# Altium schematic sheet PowerSupply.SchDoc
size A4; Author: Timo Wilfling; Address1: TH Nürnberg; Address2: Georg Simon Ohm; Address3: Kesslerplatz 10; Address4: 90489 Nürnberg; SheetNumber: 2; SheetTotal: 8
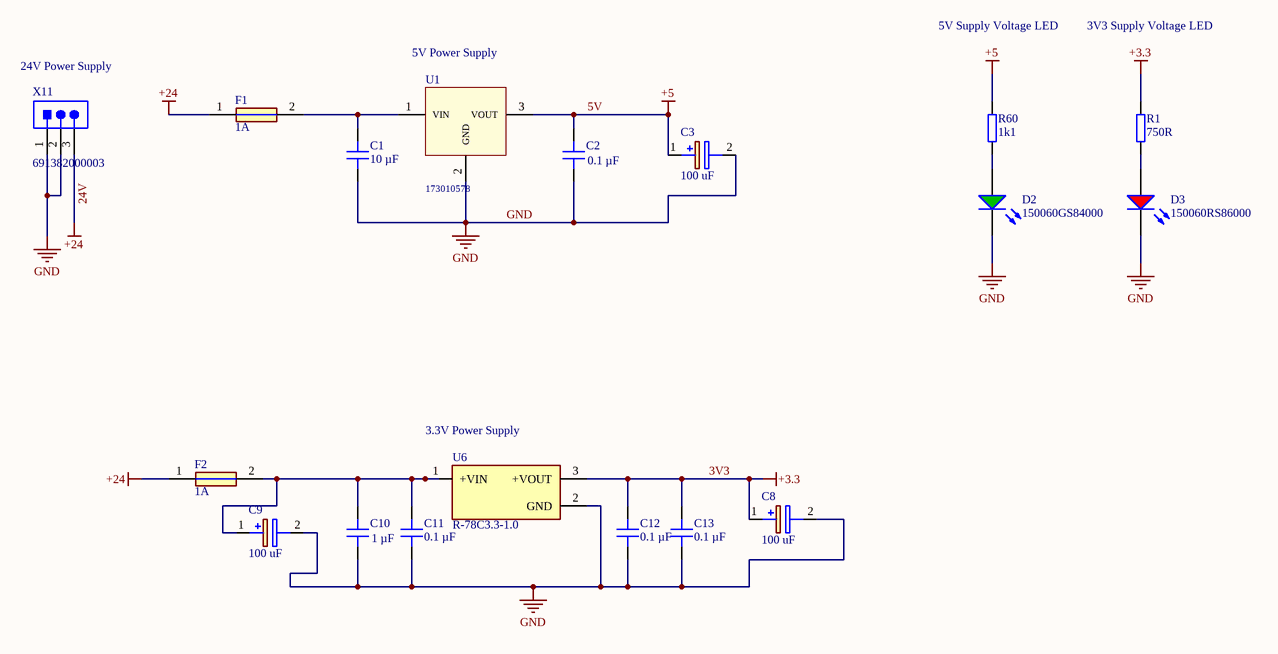
[diagram p0: PowerSupply.SchDoc]

## Parts
C1  10 µF  [C_0805]
C2  0.1 µF  [C_0603]
C3  100 uF  [CAPAE660X610N]
C8  100 uF  [CAPAE1270X1400N]
C9  100 uF  [CAPAE1270X1400N]
C10  1 µF  [C_0603]
C11  0.1 µF  [C_0603]
C12  0.1 µF  [C_0603]
C13  0.1 µF  [C_0603]
D2  150060GS84000  [WL-SMCW_0603]
D3  150060RS86000  [WL-SMCW_0603]
F1  1A  [Littlefuse_154]
F2  1A  [Littlefuse_154]
R1  750R  [RES 0603_1608]
R60  1k1  [RES 0603_1608]
U1  173010578  [FDSM_SIP-3]
U6  R-78C3.3-1.0  [CONV_R-78C3.3-1.0]
X11  691382000003  [691382000003]

## Nets
3V3: C8.1(+) C12.2 C13.2 R1.2 U6.3(+VOUT)  [also labelled +3.3]
5V: C2.2 C3.1(+) R60.2 U1.3(VOUT)  [also labelled +5]
24V: F1.1 F2.1 X11.3  [also labelled +24]
GND: C1.1 C2.1 C3.2(-) C8.2(-) C9.2(-) C10.1 C11.1 C12.1 C13.1 D2.1(K) D3.1(K) U1.2(GND) U6.2(GND) X11.1 X11.2
NetC1_2: C1.2 F1.2 U1.1(VIN)
NetC9_1: C9.1(+) C10.2 C11.2 F2.2 U6.1(+VIN)
NetD2_2: D2.2(A) R60.1
NetD3_2: D3.2(A) R1.1

## Notes on the sheet
- 24V Power Supply
- 5V Power Supply
- 5V Supply Voltage LED
- 3V3 Supply Voltage LED
- (near U6) 3.3V Power Supply
- Title
- Size:
- Date:
- A4
- Revision:
- Time:
- Sheet
- of
- Author:
- Project:

## Library data of the parts
C1 = GRM219R61E106KA12D: Capacitor 0805, 25 VDC, 10 µF, X5R; Manufacturer: muRata; Tolerance: 10 %; Voltage Rating: 25 VDC; Created from: MGremer; Manufacturer Part Number: GRM219R61E106KA12D; PartID: 13; Created On: 20.12.2020 13:54:13; ComponentLink1Description: Datasheet; ComponentLink1URL: https://www.mouser.de/datasheet/2/281/murata_03052018_GRM_Series_1-1310166.pdf; Component Type: Capacitor 0805; Device Package: 0805; Last Updated: 20.12.2020 16:34:30; Mounting Type: SMD; Operating Temperature: -55 - 85°C; Series: GRM; Supplier 1: Mouser; Supplier Part Number 1: 81-GRM219R61E106KA2D; Type: Capacitor; Value: 10 µF; Live Cycle Status: 1; Stock number: Labor SMD Container
C2 = C0603C104J3REC7411: Capacitor 0603, 25 VDC, 0.1 µF, X7R; Manufacturer: KEMET; Tolerance: 5 %; Voltage Rating: 25 VDC; Created from: MGremer; Manufacturer Part Number: C0603C104J3REC7411; PartID: 2; Created On: 20.12.2020 13:54:13; ComponentLink1Description: Datasheet; ComponentLink1URL: https://www.mouser.de/datasheet/2/212/1/KEM_C1090_X7R_ESD-1103328.pdf; Component Type: Capacitor 0603; Device Package: 0603; Last Updated: 20.12.2020 16:43:29; Mounting Type: SMD; Operating Temperature: -55 - 125°C; Series: ESD SMD Auto X7R; Supplier 1: Mouser; Supplier Part Number 1: 80-C0603C104J3RE7411; Type: Capacitor; Value: 0.1 µF; Live Cycle Status: 1; Stock number: Labor SMD Container
C3 = EEE-FK0J101V: Capacitor EEE, 6.3VDC, 100uF; Manufacturer: Panasonic; Tolerance: 20%; Created from: TWilfling; Manufacturer Part Number: EEE-FK0J101V; PartID: 71; Created On: 28.05.2021 17:07:38; ComponentLink1Description: Datasheet; ComponentLink1URL: https://www.mouser.de/datasheet/2/315/ABA0000C1181-947564.pdf; Component Type: Capacitor Al Electrolyt; Device Package: EEE; Last Updated: 28.05.2021 17:48:36; Mounting Type: SMD; Operating Temperature: -55 - 105°C; Series: FK-V; Supplier 1: Mouser; Supplier Part Number 1: 667-EEE-FK0J101V; Type: Capacitor; Voltage Rating: 6.3 VDC; Value: 100 uF; Live Cycle Status: 1; Stock number: not stored
C8 C9 = MAL216099101E3: Capacitor Al Electrolyt, 100 uF, 50VDC; Manufacturer: Vishay; Tolerance: 20%; Created from: TWilfling; Manufacturer Part Number: MAL216099101E3; PartID: 72; Created On: 28.05.2021 17:32:00; ComponentLink1Description: Datasheet; ComponentLink1URL: https://www.mouser.de/datasheet/2/427/160cla-1762101.pdf; Component Type: Capacitor Al Electrolyt; Last Updated: 28.05.2021 17:47:40; Mounting Type: SMD; Operating Temperature: -55 - 150°C; Series: 160 CLA; Supplier 1: Mouser; Supplier Part Number 1: 594-MAL216099101E3; Type: Capacitor; Voltage Rating: 50 VDC; Value: 100 uF; Live Cycle Status: 1; Stock number: not stored
C10 = UMK107AB7105KA-T: Capacitor 0603, 50 VDC, 1 µF, X7R; Manufacturer: Taiyo Yuden; Tolerance: 10 %; Voltage Rating: 50 VDC; Created from: MGremer; Manufacturer Part Number: UMK107AB7105KA-T; PartID: 5; Created On: 20.12.2020 13:54:13; ComponentLink1Description: Datasheet; ComponentLink1URL: https://www.mouser.de/datasheet/2/396/mlcc02_e-1307760.pdf; Component Type: Capacitor 0603; Device Package: 0603; Last Updated: 20.12.2020 16:42:28; Mounting Type: SMD; Operating Temperature: -55 - 125°C; Series: M; Supplier 1: Mouser; Supplier Part Number 1: 963-UMK107AB7105KA-T; Type: Capacitor; Value: 1 µF; Live Cycle Status: 1; Stock number: Labor SMD Container
C11-C13 = C0603X104K5RAC7411: Capacitor 0603, 50 VDC, 0.1 µF, X7R; Manufacturer: KEMET; Tolerance: 10 %; Voltage Rating: 50 VDC; Created from: MGremer; Manufacturer Part Number: C0603X104K5RAC7411; PartID: 3; Created On: 20.12.2020 13:54:13; ComponentLink1Description: Datasheet; ComponentLink1URL: https://www.mouser.de/datasheet/2/212/1/KEM_C1013_X7R_FT_CAP_SMD-1103280.pdf; Component Type: Capacitor 0603; Device Package: 0603; Last Updated: 04.03.2021 09:24:28; Mounting Type: SMD; Operating Temperature: -55 - 125°C; Series: SMD Comm X7R Flex; Supplier 1: Mouser; Supplier Part Number 1: 80-C0603X104K5R7411; Supplier 2: LCSC; Supplier Part Number 2: C14663; Type: Capacitor; Value: 0.1 µF; Live Cycle Status: 1; LCSC Part Number: C14663; Stock number: Labor SMD Container
D2 = 150060GS84000: WL-SMCW SMD Mono-color Chip LED Waterclear Green; Manufacturer: Wuerth Elektronik; Type: Standard; Created from: MGremer; Forward Current I_f: 20 mA; Forward Voltage U_f: 3.2 V; Wavelength: 525 nm; Light Intensity: 3000 mcd; Nominal Power: 78 mW; Manufacturer Part Number: 150060GS84000; PartID: 2; Created On: 08.12.2020 10:41:11; ComponentLink1Description: Datasheet; ComponentLink1URL: https://www.mouser.de/datasheet/2/445/150060GS75020-1714345.pdf; Component Type: LED Diode; Device Package: 0603; Last Updated: 03.03.2021 09:59:51; Mounting Type: SMD; Operating Temperature: -40 - 85 °C; Supplier 1: Mouser; Supplier Part Number 1: 710-150060GS84000; Supplier 2: Farnell; Supplier Part Number 2: 3408612; Supplier 3: Digi-Key; Supplier Part Number 3: 732-150060GS84000CT-ND; Live Cycle Status: 1; Stock number: not stored; Color: green
D3 = 150060RS86000: WL-SMCW SMD Mono-color Chip LED Waterclear Red; Manufacturer: Wuerth Elektronik; Type: Standard; Created from: MGremer; Forward Current I_f: 20 mA; Forward Voltage U_f: 2 V; Wavelength: 624 nm; Light Intensity: 800 mcd; Nominal Power: 48 mW; Manufacturer Part Number: 150060RS86000; PartID: 3; Created On: 08.12.2020 10:48:12; ComponentLink1Description: Datasheet; ComponentLink1URL: https://www.mouser.de/datasheet/2/445/150120RS75000-1714636.pdf; Component Type: LED Diode; Device Package: 0603; Last Updated: 03.03.2021 09:59:52; Mounting Type: SMD; Operating Temperature: -40 - 85 °C; Supplier 1: Mouser; Supplier Part Number 1: 710-150060RS86000; Supplier 2: Farnell; Supplier Part Number 2: 3408608; Supplier 3: Digi-Key; Supplier Part Number 3: 732-150060RS86000CT-ND; Live Cycle Status: 1; Stock number: not stored; Color: red
F1 F2 = 0154001.DR: Duse OMNI BLOK 154; Manufacturer: Littelfuse; Type: Fuse; Nominal voltage AC: 125 VAC; Nominal voltage DC: 125 VDC; Resistance: 78 mOhm; Created from: TWilfling; Manufacturer Part Number: 0154001.DR; PartID: 4; Created On: 07.05.2021 06:50:33; ComponentLink1Description: Datasheet; ComponentLink1URL: https://www.mouser.de/datasheet/2/240/Littelfuse_Fuse_154_154T_154L_154TL_Datasheet_pdf-365375.pdf; Component Type: NAN02 - 154 OMNI-BLOK; Device Package: OMNI-BLOK; Last Updated: 11.05.2021 11:17:19; Mounting Type: SMD; Operating Temperature: -55 - 125 °C; Series: 154; Supplier 1: Mouser; Supplier Part Number 1: 576-0154001.DR; Nominal current: 1 A; Value: 1 A; Live Cycle Status: 1; Stock number: not stored
R1 = RK73B1JTTDD751J: SMD resistor E24 series; Manufacturer: KOA Speer; Tolerance: 5%; Created from: MGremer; Manufacturer Part Number: RK73B1JTTDD751J; PartID: 71; Created On: 14.12.2020 16:17:14; ComponentLink1Description: Datasheet; ComponentLink1URL: https://www.mouser.de/datasheet/2/219/RK73B-1825463.pdf; Component Type: SMD resistor; Device Package: 0603; Last Updated: 02.03.2021 14:07:32; Mounting Type: SMD; Supplier 1: Mouser; Supplier Part Number 1: 660-RK73B1JTTDD751J; Type: Resistor; Value: 750R; Live Cycle Status: 1; Stock number: Labor SMD Container
R60 = RK73B1JTTDD112J: SMD resistor E24 series; Manufacturer: KOA Speer; Tolerance: 5%; Created from: MGremer; Manufacturer Part Number: RK73B1JTTDD112J; PartID: 75; Created On: 14.12.2020 16:17:14; ComponentLink1Description: Datasheet; ComponentLink1URL: https://www.mouser.de/datasheet/2/219/RK73B-1825463.pdf; Component Type: SMD resistor; Device Package: 0603; Last Updated: 02.03.2021 14:07:32; Mounting Type: SMD; Supplier 1: Mouser; Supplier Part Number 1: 660-RK73B1JTTDD112J; Type: Resistor; Value: 1k1; Live Cycle Status: 1; Stock number: Labor SMD Container
U1 = 173010578: Not isolated DCDC Converter 5 V Output, 1 A, 8 - 28 V Input; Manufacturer: Wuerth Elektronik; Value: 5 W; Created from: MGremer; Manufacturer Part Number: 173010578; PartID: 11; Created On: 06.01.2021 09:48:37; ComponentLink1Description: Datasheet; ComponentLink1URL: https://www.mouser.de/datasheet/2/445/173010578-1716125.pdf; Component Type: Not isolated DCDC Converter; Device Package: FDSM; Last Updated: 06.05.2021 06:17:55; Mounting Type: THT; Series: MagI3C-FDSM; Supplier 1: Mouser; Supplier Part Number 1: 710-173010578; Type: not isolated DCDC converter; Live Cycle Status: 1; Stock number: not stored
U6 = R-78C3.3-1.0: Not isolated DCDC Converter 3V3 Output, 1A, 7 - 42V Input; Manufacturer: RECOM; Value: 3V3@1A; Created from: TWilfling; Manufacturer Part Number: R-78C3.3-1.0; PartID: 15; Created On: 10.05.2021 11:04:05; ComponentLink1Description: Datasheet; ComponentLink1URL: https://docs.rs-online.com/9d1a/0900766b8135f258.pdf; Component Type: Not isolated DCDC Convert; Device Package: SIP-3; Last Updated: 11.05.2021 09:24:43; Mounting Type: THT; Operating Temperature: -40 - 85°C; Series: R-78C-1.0; Supplier 1: RS; Supplier Part Number 1: 739-8297; Type: not isolated DCDC converter; Live Cycle Status: 1; Stock number: not stored
X11 = 691382000003: 2.5mm Single Row 3-pol Vertical PCB Header; Manufacturer: Wurth; Created from: TWilfling; Number of positions: 3; Manufacturer Part Number: 691382000003; PartID: 47; Created On: 29.04.2021 14:24:57; ComponentLink1Description: Homepage; ComponentLink1URL: https://www.we-online.de/katalog/de/TBL_2_50_382_VERTICAL_PCB_HEADER_69138200000X?sq=691382000003#691382000003; ComponentLink2Description: Datasheet; ComponentLink2URL: https://www.we-online.de/katalog/datasheet/691382000003.pdf; Component Type: Wurth Connector; Device Package: Connector; Last Updated: 29.04.2021 14:52:34; Mounting Type: THT; Supplier 1: Wurth; Supplier Part Number 1: 691382000003; Type: Connector; Live Cycle Status: 1; Number of rows: 1; Stock number: not stored